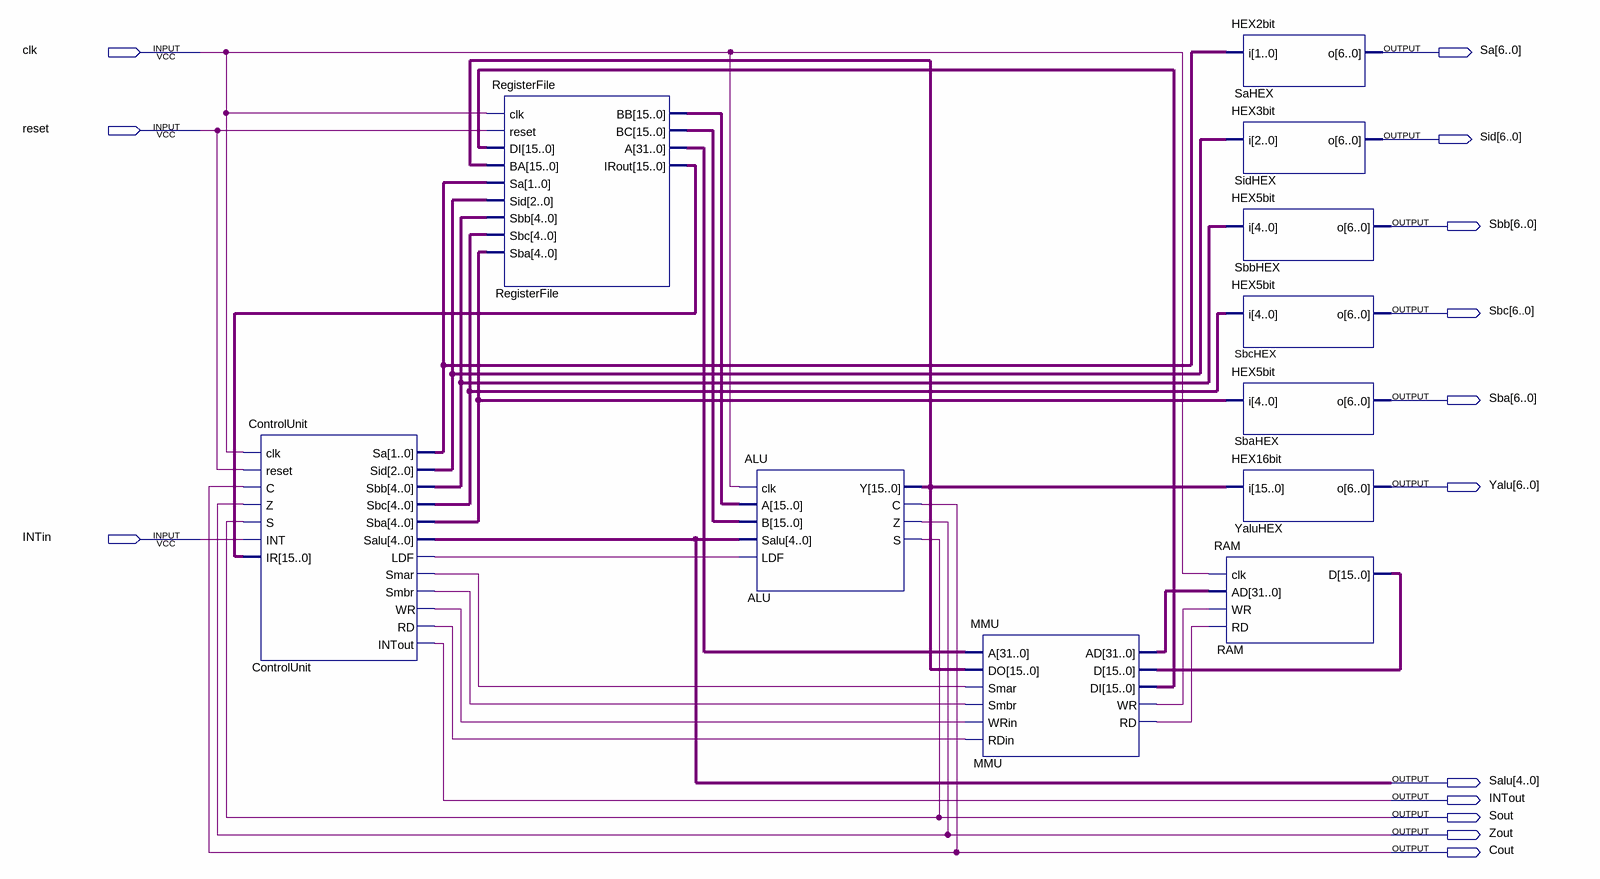
[diagram p0: schematic sheet]
// Quartus schematic CPU16bit-FPGA-Altera-MAX10.bdf as structural Verilog: 11 symbols, 14 pins
module \CPU16bit-FPGA-Altera-MAX10  (
  input  clk,
  input  reset,
  input  INTin,
  output [6:0] Sa,
  output [6:0] Sid,
  output [6:0] Sbb,
  output [6:0] Sbc,
  output [6:0] Sba,
  output [6:0] Yalu,
  output [4:0] Salu,
  output INTout,
  output Sout,
  output Zout,
  output Cout
);

  wire ControlUnit_ldf, ControlUnit_rd, ControlUnit_smar, ControlUnit_smbr, ControlUnit_wr, MMU_rd, MMU_wr;
  wire [1:0] ControlUnit_sa;
  wire [2:0] ControlUnit_sid;
  wire [4:0] ControlUnit_sba, ControlUnit_sbb, ControlUnit_sbc;
  wire [15:0] ALU_y, MMU_d, MMU_di, RegisterFile_bb, RegisterFile_bc, RegisterFile_irout;
  wire [31:0] MMU_ad, RegisterFile_a;

  ControlUnit ControlUnit (
    .clk(clk), .reset(reset), .C(Cout), .Z(Zout), .S(Sout), .INT(INTin), .IR(RegisterFile_irout),
    .Sa(ControlUnit_sa), .Sid(ControlUnit_sid), .Sbb(ControlUnit_sbb), .Sbc(ControlUnit_sbc),
    .Sba(ControlUnit_sba), .Salu(Salu), .LDF(ControlUnit_ldf), .Smar(ControlUnit_smar),
    .Smbr(ControlUnit_smbr), .WR(ControlUnit_wr), .RD(ControlUnit_rd), .INTout(INTout));
  RegisterFile RegisterFile (
    .clk(clk), .reset(reset), .DI(MMU_di), .BA(ALU_y), .Sa(ControlUnit_sa), .Sid(ControlUnit_sid),
    .Sbb(ControlUnit_sbb), .Sbc(ControlUnit_sbc), .Sba(ControlUnit_sba), .BB(RegisterFile_bb),
    .BC(RegisterFile_bc), .A(RegisterFile_a), .IRout(RegisterFile_irout));
  ALU ALU (
    .clk(clk), .A(RegisterFile_bb), .B(RegisterFile_bc), .Salu(Salu), .LDF(ControlUnit_ldf), .Y(ALU_y),
    .C(Cout), .Z(Zout), .S(Sout));
  MMU MMU (
    .A(RegisterFile_a), .DO(ALU_y), .Smar(ControlUnit_smar), .Smbr(ControlUnit_smbr), .WRin(ControlUnit_wr),
    .RDin(ControlUnit_rd), .AD(MMU_ad), .DI(MMU_di), .WR(MMU_wr), .RD(MMU_rd), .D(MMU_d));
  HEX2bit SaHEX (.i(ControlUnit_sa), .o(Sa));
  HEX3bit SidHEX (.i(ControlUnit_sid), .o(Sid));
  HEX5bit SbbHEX (.i(ControlUnit_sbb), .o(Sbb));
  HEX5bit SbcHEX (.i(ControlUnit_sbc), .o(Sbc));
  HEX5bit SbaHEX (.i(ControlUnit_sba), .o(Sba));
  HEX16bit YaluHEX (.i(ALU_y), .o(Yalu));
  RAM RAM (.clk(clk), .AD(MMU_ad), .WR(MMU_wr), .RD(MMU_rd), .D(MMU_d));
endmodule
